# Altium project BLDC_driver.PrjPcb
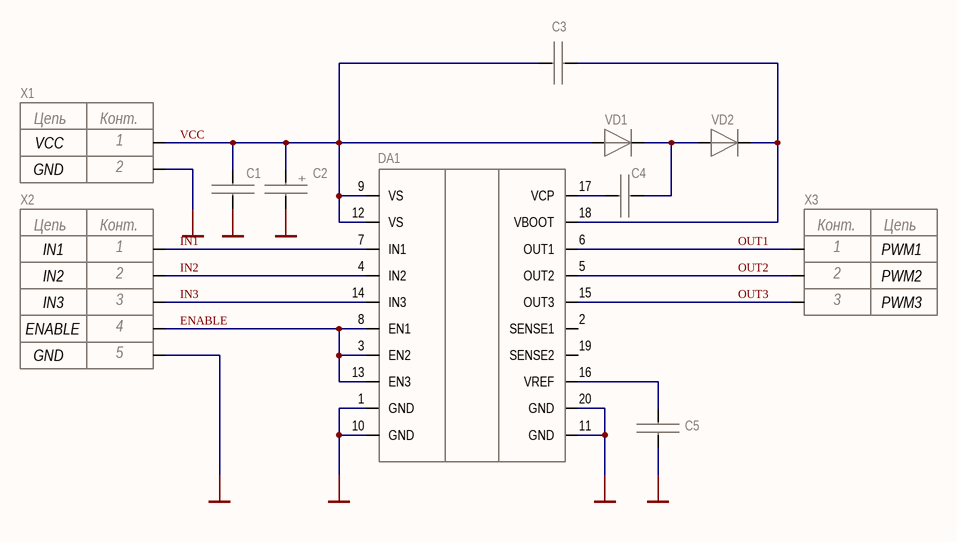
[diagram p0: BLDC_driver.SchDoc]
1 sheet, 11 parts. Net scope: global (net labels, ports and power ports of the same name join across sheets).
Board file: BLDC_driver.PcbDoc

## Sheet BLDC_driver.SchDoc
size 209 x 297 mm; Author: Комахин М.О.; SheetNumber: 1; SheetTotal: 1; PageSetup: Record=PageOptions|CenterHorizontal=True|CenterVertical=True|PrintScale=0.94|XCorrection=1.00|YCorrection=1.00|PrintKind=1|BorderSize=5000000|LeftOffset=0|BottomOffset=0|Orientation=1|PaperLength=1000|PaperWidth=1000|Scale=100|PaperSource=7|PrintQuality=-4|MediaType=1|DitherType=10|PaperKind=A4|PrintScaleMode=1; DecimalNumber: АБВГ.123.456.789; MainDevice: Перв.примен.; Name: Драйвер BLDC двигателя

### Parts
C1  C_0.1uF  [CAP_1206]  (value not drawn)
C2  C_POL_100uF_25V  [CAP_EL_100uF_25V]  (value not drawn)
C3  C_0.22uF  [CAP_1206]  (value not drawn)
C4  C_10nF  [CAP_1206]  (value not drawn)
C5  C_1uF  [CAP_1206]  (value not drawn)
DA1  L6234PD  [POWERSO-20]  (value not drawn)
VD1  VD_1N4148WS  [SOD323]  (value not drawn)
VD2  VD_1N4148WS  [SOD323]  (value not drawn)
X1  TERMINAL_BLOCK  [Terminal_Block_2x]  (value not drawn)
X2  PLS5  [PLS5]  (value not drawn)
X3  PLS3  [PLS3]  (value not drawn)

### Nets
GND: C1.1 C2.2 C5.1 DA1.1(GND) DA1.10(GND) DA1.11(GND) DA1.20(GND) X1.2(GND) X2.5(GND)
ENABLE: DA1.3(EN2) DA1.8(EN1) DA1.13(EN3) X2.4(ENABLE)
IN1: DA1.7(IN1) X2.1(IN1)
IN2: DA1.4(IN2) X2.2(IN2)
IN3: DA1.14(IN3) X2.3(IN3)
OUT1: DA1.6(OUT1) X3.1(PWM1)
OUT2: DA1.5(OUT2) X3.2(PWM2)
OUT3: DA1.15(OUT3) X3.3(PWM3)
VCC: C1.2 C2.1 C3.1 DA1.9(VS) DA1.12(VS) VD1.1 X1.1(VCC)
NetC3_2: C3.2 DA1.18(VBOOT) VD2.2
NetC4_1: C4.1 DA1.17(VCP)
NetC4_2: C4.2 VD1.2 VD2.1
NetC5_2: C5.2 DA1.16(VREF)

Not connected (* = marked no-connect by the designer): DA1 2(SENSE1) 19(SENSE2)

### Notes on the sheet
- Перв.примен.
- Справ.№
- Подп. и дата
- Инв.№ дубл.
- Взам.инв.№
- Подп.и дата
- Разраб.
- Изм.
- Лист
- № докум.
- Подп.
- Дата
- Лит.
- Масштаб
- Масса
- Т.контр.
- Пров.
- СХЕМА   ЭЛЕКТРИЧЕСКАЯ
- ПРИНЦИПИАЛЬНАЯ
- Листов
- Инв.№ подл.
- Утв.
- Н.контр.
- Нач.сект.
- Копировал
- Формат  A4
- (in symbol C_POL_100uF_25V) +
- (in symbol PLS3) Конт.; Цепь
- (in symbol PLS5) Цепь; Конт.
- (in symbol TERMINAL_BLOCK) Цепь; Конт.